# Altium schematic sheet Top.SchDoc
size A4; SheetNumber: 2; SheetTotal: 10
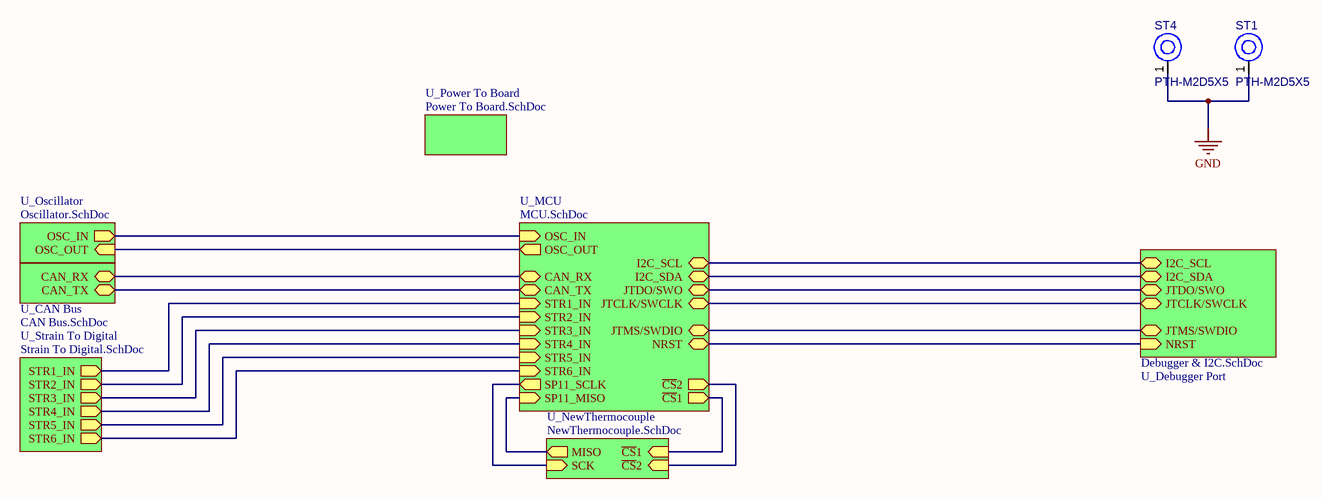
[diagram p0: Top.SchDoc]

## Parts
ST1  PTH-M2D5X5  [PTH-M2D5X5]
ST4  PTH-M2D5X5  [PTH-M2D5X5]

## Sub-sheets
U_CAN Bus = CAN Bus.SchDoc: CAN_RX (bidir), CAN_TX (bidir)
U_Debugger Port = Debugger & I2C.SchDoc: JTDO/SWO (bidir), JTCLK/SWCLK (bidir), JTMS/SWDIO (bidir), NRST (in), I2C_SDA (bidir), I2C_SCL (bidir)
U_MCU = MCU.SchDoc: I2C_SDA (bidir), I2C_SCL (bidir), JTMS/SWDIO (bidir), JTCLK/SWCLK (bidir), JTDO/SWO (bidir), NRST (bidir), OSC_OUT (out), OSC_IN (in), SP11_SCLK (out), SP11_MISO (in), CAN_RX (bidir), CAN_TX (bidir), STR2_IN (in), STR3_IN (in), STR5_IN (in), STR1_IN (in), STR6_IN (in), STR4_IN (in), ~{CS}2 (out), ~{CS}1 (out)
U_NewThermocouple = NewThermocouple.SchDoc: ~{CS}1 (in), ~{CS}2 (in), MISO (out), SCK (in)
U_Oscillator = Oscillator.SchDoc: OSC_IN (out), OSC_OUT (in)
U_Power To Board = Power To Board.SchDoc: no entries
U_Strain To Digital = Strain To Digital.SchDoc: STR1_IN (out), STR2_IN (out), STR4_IN (out), STR5_IN (out), STR3_IN (out), STR6_IN (out)

## Nets
GND: ST1.1(H1) ST4.1(H1)
(unnamed): sheet U_MCU/I2C_SDA, sheet U_Debugger Port/I2C_SDA
(unnamed): sheet U_MCU/I2C_SCL, sheet U_Debugger Port/I2C_SCL
(unnamed): sheet U_MCU/JTMS/SWDIO, sheet U_Debugger Port/JTMS/SWDIO
(unnamed): sheet U_MCU/JTCLK/SWCLK, sheet U_Debugger Port/JTCLK/SWCLK
(unnamed): sheet U_MCU/JTDO/SWO, sheet U_Debugger Port/JTDO/SWO
(unnamed): sheet U_MCU/NRST, sheet U_Debugger Port/NRST
(unnamed): sheet U_MCU/OSC_OUT, sheet U_Oscillator/OSC_OUT
(unnamed): sheet U_MCU/OSC_IN, sheet U_Oscillator/OSC_IN
(unnamed): sheet U_MCU/SP11_SCLK, sheet U_NewThermocouple/SCK
(unnamed): sheet U_MCU/SP11_MISO, sheet U_NewThermocouple/MISO
(unnamed): sheet U_MCU/CAN_RX, sheet U_CAN Bus/CAN_RX
(unnamed): sheet U_MCU/CAN_TX, sheet U_CAN Bus/CAN_TX
(unnamed): sheet U_MCU/STR2_IN, sheet U_Strain To Digital/STR2_IN
(unnamed): sheet U_MCU/STR3_IN, sheet U_Strain To Digital/STR3_IN
(unnamed): sheet U_MCU/STR5_IN, sheet U_Strain To Digital/STR5_IN
(unnamed): sheet U_MCU/STR1_IN, sheet U_Strain To Digital/STR1_IN
(unnamed): sheet U_MCU/STR6_IN, sheet U_Strain To Digital/STR6_IN
(unnamed): sheet U_MCU/STR4_IN, sheet U_Strain To Digital/STR4_IN
(unnamed): sheet U_MCU/~{CS}2, sheet U_NewThermocouple/~{CS}2
(unnamed): sheet U_MCU/~{CS}1, sheet U_NewThermocouple/~{CS}1

## Library data of the parts
ST1 ST4 = CMP-00028-00004-1: M2 PTH (2.5mm), 5mm pad; Pins: 1